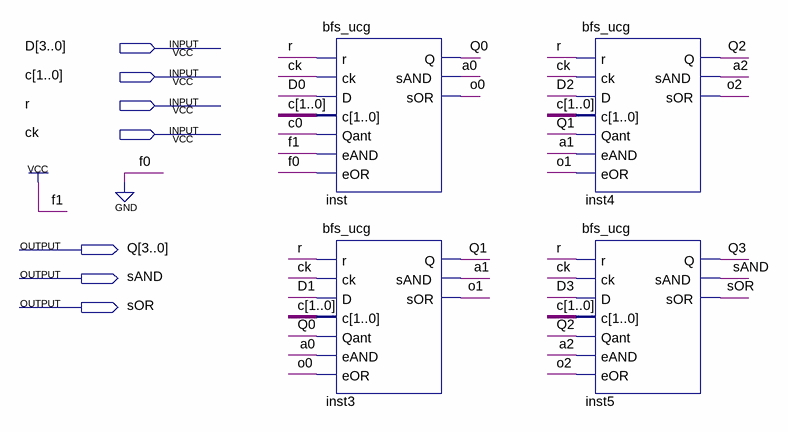
[diagram p0: schematic sheet]
// Quartus schematic bfs_ucg_4bits.bdf as structural Verilog: 4 symbols, 7 pins
module bfs_ucg_4bits (
  input  [3:0] D,
  input  [1:0] c,
  input  r,
  input  ck,
  output [3:0] Q,
  output sAND,
  output sOR
);

  wire a0, a1, a2, o0, o1, o2;

  bfs_ucg inst (.r(r), .ck(ck), .D(D[0]), .c(c), .Qant(c[0]), .eAND(1'b1), .eOR(1'b0), .Q(Q[0]), .sAND(a0), .sOR(o0));
  bfs_ucg inst3 (.r(r), .ck(ck), .D(D[1]), .c(c), .Qant(Q[0]), .eAND(a0), .eOR(o0), .Q(Q[1]), .sAND(a1), .sOR(o1));
  bfs_ucg inst4 (.r(r), .ck(ck), .D(D[2]), .c(c), .Qant(Q[1]), .eAND(a1), .eOR(o1), .Q(Q[2]), .sAND(a2), .sOR(o2));
  bfs_ucg inst5 (.r(r), .ck(ck), .D(D[3]), .c(c), .Qant(Q[2]), .eAND(a2), .eOR(o2), .Q(Q[3]), .sAND(sAND), .sOR(sOR));
endmodule
